# EAGLE design Dispenser (EAGLE 6.3)
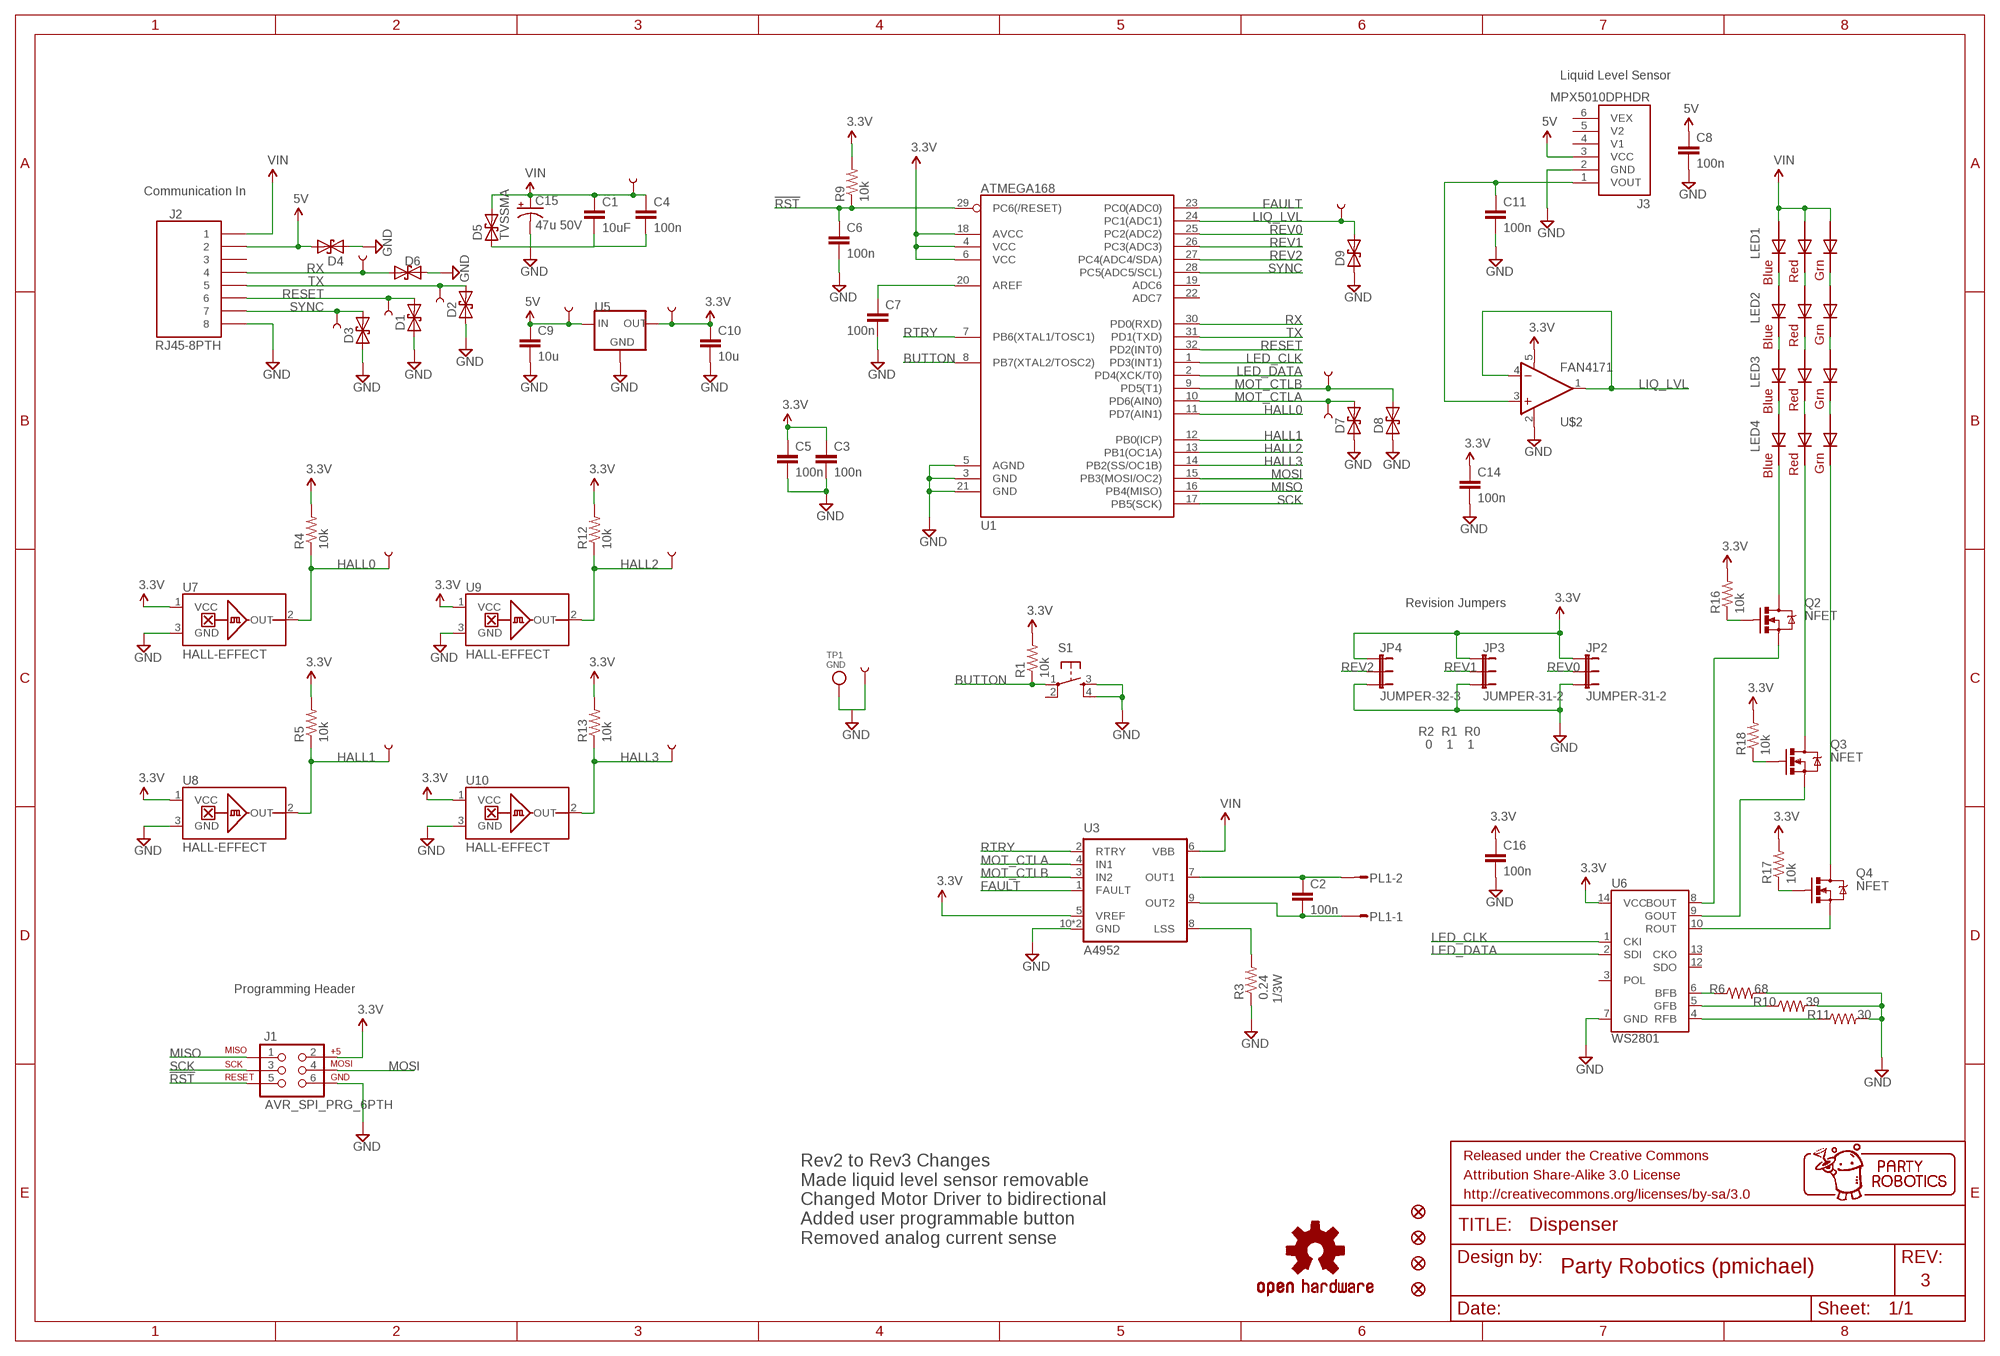
[diagram p0: schematic, sheet 1]

## Parts
C1  10uF  2.2UF-CERCAP-10009  [1206]
C2  100n  CAP0603-CAP  [0603-CAP]
C3  100n  CAP0603-CAP  [0603-CAP]
C4  100n  CAP0603-CAP  [0603-CAP]
C5  100n  CAP0603-CAP  [0603-CAP]
C6  100n  CAP0603-CAP  [0603-CAP]
C7  100n  CAP0603-CAP  [0603-CAP]
C8  100n  CAP0603-CAP  [0603-CAP]
C9  10u  CAP0603-CAP  [0603-CAP]
C10  10u  CAP0603-CAP  [0603-CAP]
C11  100n  CAP0603-CAP  [0603-CAP]
C14  100n  CAP0603-CAP  [0603-CAP]
C15  47u 50V  CAP_POLD  [PANASONIC_D]
C16  100n  CAP0603-CAP  [0603-CAP]
D1  TVSSOD-923  [SOD-923]
D2  TVSSOD-923  [SOD-923]
D3  TVSSOD-923  [SOD-923]
D4  TVSSOD-923  [SOD-923]
D5  TVSSMA  [SMA-DIODE]
D6  TVSSOD-923  [SOD-923]
D7  TVSSOD-923  [SOD-923]
D8  TVSSOD-923  [SOD-923]
D9  TVSSOD-923  [SOD-923]
FRAME3  FRAME-LETTER  [CREATIVE_COMMONS]
J1  AVR_SPI_PRG_6PTH  [2X3]
J2  RJ45-8PTH  [RJ45-8]
J3  MPX5010DPHDR  [MPX5010_HDR]
JP2  JUMPER-31-2  [SJ_3_PASTE1&2]
JP3  JUMPER-31-2  [SJ_3_PASTE1&2]
JP4  JUMPER-32-3  [SJ_3_PASTE2&3]
JP5  FIDUCIAL1X2  [FIDUCIAL-1X2]
JP6  FIDUCIAL1X2  [FIDUCIAL-1X2]
JP7  FIDUCIAL1X2  [FIDUCIAL-1X2]
JP8  FIDUCIAL1X2  [FIDUCIAL-1X2]
LED1  RGBLED5050  [RGBLED5050]
LED2  RGBLED5050  [RGBLED5050]
LED3  RGBLED5050  [RGBLED5050]
LED4  RGBLED5050  [RGBLED5050]
PL1  DF3-02P  [DF3P-02]
Q2  NFET  MOSFET-NCHANNELSMD  [SOT23-3]
Q3  NFET  MOSFET-NCHANNELSMD  [SOT23-3]
Q4  NFET  MOSFET-NCHANNELSMD  [SOT23-3]
R1  10k  RESISTOR0603-RES  [0603-RES]
R3  0.24  RESISTOR0805-RES  [0805]
R4  10k  RESISTOR0603-RES  [0603-RES]
R5  10k  RESISTOR0603-RES  [0603-RES]
R6  68  RESISTOR0603-RES  [0603-RES]
R9  10k  RESISTOR0603-RES  [0603-RES]
R10  39  RESISTOR0603-RES  [0603-RES]
R11  30  RESISTOR0603-RES  [0603-RES]
R12  10k  RESISTOR0603-RES  [0603-RES]
R13  10k  RESISTOR0603-RES  [0603-RES]
R16  10k  RESISTOR0603-RES  [0603-RES]
R17  10k  RESISTOR0603-RES  [0603-RES]
R18  10k  RESISTOR0603-RES  [0603-RES]
S1  TAC_SWITCHSMD  [TACTILE_SWITCH_SMD]
TP1  GND  TESTPOINT  [TESTPOINT_SMT]
TP2  TEST-POINT0.08  [PAD_0.08]
TP3  TEST-POINT0.08  [PAD_0.08]
TP4  TEST-POINT0.08  [PAD_0.08]
TP5  TEST-POINT0.08  [PAD_0.08]
TP6  TEST-POINT0.08  [PAD_0.08]
TP7  TEST-POINT3X5  [PAD.03X.05]
TP8  TEST-POINT3X5  [PAD.03X.05]
TP9  TEST-POINT3X5  [PAD.03X.05]
TP10  TEST-POINT3X5  [PAD.03X.05]
TP11  TEST-POINT3X5  [PAD.03X.05]
TP12  TEST-POINT3X5  [PAD.03X.05]
TP13  TEST-POINT0.08  [PAD_0.08]
TP14  TEST-POINT0.08  [PAD_0.08]
TP15  TEST-POINT0.08  [PAD_0.08]
TP16  TEST-POINT0.08  [PAD_0.08]
U1  ATMEGA168  [TQFP32-08]
U3  A4952  [MSOP-10-GNDPAD]
U5  VREG-5V-LDO-AP1117SOT89-3L  [SOT89-3L]
U6  WS2801  [SOP-14]
U7  HALL-EFFECT  [SOT23-3]
U8  HALL-EFFECT  [SOT23-3]
U9  HALL-EFFECT  [SOT23-3]
U10  HALL-EFFECT  [SOT23-3]
U$1  OSHW-LOGOM  [OSHW-LOGO-M]
U$2  FAN4171  OPA344  [SOT23-5]

## Nets
1/3W: R3.2 U3.8(LSS)
3.3V: C3.1 C5.1 C10.1 C14.1 C16.1 J1.2 JP2.1 JP3.1 JP4.1 R1.2 R4.2 R5.2 R9.2 R12.2 R13.2 R16.2 R17.2 R18.2 TP16.P$1 U1.4(VCC) U1.6(VCC) U1.18(AVCC) U3.5(VREF) U5.2(OUT) U5.2.1(OUT) U6.14(VCC) U7.1(VCC) U8.1(VCC) U9.1(VCC) U10.1(VCC) U$2.5(V+)
5V: C8.1 C9.1 D4.C J2.2 J3.3(VCC) TP3.P$1 U5.3(IN)
!RST: C6.1 J1.5 R9.1 U1.29(PC6(/RESET))
BLUE: Q2.2(S) U6.8(BOUT)
BUTTON: R1.1 S1.1 U1.8(PB7(XTAL2/TOSC2))
FAULT: U1.23(PC0(ADC0)) U3.1(FAULT)
GND: C1.2 C3.2 C4.2 C5.2 C6.2 C7.2 C8.2 C9.2 C10.2 C11.2 C14.2 C15.- C16.2 D1.A D2.A D3.A D4.A D5.A D6.A D7.A D8.A D9.A J1.6 J2.8 J3.2(GND) JP2.3 JP3.3 JP4.3 R3.1 R6.2 R10.2 R11.2 S1.3 S1.4 TP1.P$1 TP2.P$1 U1.3(GND) U1.5(AGND) U1.21(GND) U3.10(GND) U3.GND U5.1(GND) U6.7(GND) U7.3(GND) U8.3(GND) U9.3(GND) U10.3(GND) U$2.2(V-)
GREEN: Q3.2(S) U6.9(GOUT)
HALL0: R4.1 TP10.P$1 U1.11(PD7(AIN1)) U7.2(OUT)
HALL1: R5.1 TP11.P$1 U1.12(PB0(ICP)) U8.2(OUT)
HALL2: R12.1 TP9.P$1 U1.13(PB1(OC1A)) U9.2(OUT)
HALL3: R13.1 TP12.P$1 U1.14(PB2(SS/OC1B)) U10.2(OUT)
LED_CLK: U1.1(PD3(INT1)) U6.1(CKI)
LED_DATA: U1.2(PD4(XCK/T0)) U6.2(SDI)
LIQ_LVL: D9.C TP14.P$1 U1.24(PC1(ADC1)) U$2.1(OUT) U$2.4(-IN)
MISO: J1.1 U1.16(PB4(MISO))
MOSI: J1.4 U1.15(PB3(MOSI/OC2))
MOT_CTLA: D7.C TP8.P$1 U1.10(PD6(AIN0)) U3.4(IN1)
MOT_CTLB: D8.C TP7.P$1 U1.9(PD5(T1)) U3.3(IN2)
N$1: C7.1 U1.20(AREF)
N$2: Q3.1(G) R18.1
N$4: Q4.1(G) R17.1
N$5: Q2.1(G) R16.1
N$6: R6.1 U6.6(BFB)
N$7: R10.1 U6.5(GFB)
N$8: R11.1 U6.4(RFB)
N$9: C2.1 PL1.2 U3.7(OUT1)
N$10: C2.2 PL1.1 U3.9(OUT2)
N$12: LED4.6(BLUE_C) Q2.3(D)
N$13: LED4.5(RED_C) Q3.3(D)
N$14: LED4.4(GREEN_C) Q4.3(D)
N$17: Q4.2(S) U6.10(ROUT)
N$26: C11.1 J3.1(VOUT) U$2.3(+IN)
N$28: LED3.6(BLUE_C) LED4.1(BLUE_A)
N$34: LED3.5(RED_C) LED4.2(RED_A)
N$37: LED3.4(GREEN_C) LED4.3(GREEN_A)
N$38: LED2.4(GREEN_C) LED3.3(GREEN_A)
N$39: LED2.5(RED_C) LED3.2(RED_A)
N$40: LED2.6(BLUE_C) LED3.1(BLUE_A)
N$41: LED1.4(GREEN_C) LED2.3(GREEN_A)
N$42: LED1.5(RED_C) LED2.2(RED_A)
N$43: LED1.6(BLUE_C) LED2.1(BLUE_A)
RESET: D1.C J2.6 TP13.P$1 U1.32(PD2(INT0))
REV0: JP2.2 U1.25(PC2(ADC2))
REV1: JP3.2 U1.26(PC3(ADC3))
REV2: JP4.2 U1.27(PC4(ADC4/SDA))
RTRY: U1.7(PB6(XTAL1/TOSC1)) U3.2(RTRY)
RX: D6.C J2.4 TP4.P$1 U1.30(PD0(RXD))
SCK: J1.3 U1.17(PB5(SCK))
SYNC: D3.C J2.7 TP15.P$1 U1.28(PC5(ADC5/SCL))
TX: D2.C J2.5 TP5.P$1 U1.31(PD1(TXD))
VIN: C1.1 C4.1 C15.+ D5.C J2.1 LED1.1(BLUE_A) LED1.2(RED_A) LED1.3(GREEN_A) TP6.P$1 U3.6(VBB)
Unconnected: J2.3 J3.4(V1) J3.5(V2) J3.6(VEX) S1.2 U1.19(ADC6) U1.22(ADC7) U6.3(POL) U6.12(SDO) U6.13(CKO)

## Notes on the sheet
- Liquid Level Sensor
- Communication In
- Revision Jumpers
- R2  R1  R0
- 0    1    1
- Programming Header
- Rev2 to Rev3 Changes
  Made liquid level sensor removable
  Changed Motor Driver to bidirectional
  Added user programmable button
  Removed analog current sense
- Party Robotics (pmichael)
- 3
- C:/Users/Pierre/Dropbox/PartyRobotics/PartyRoboticsLogo/BW/Eagle-sch-logo.bmp

## Library data of the parts
C1 = SparkFun-Capacitors:2.2UF-CER: 2.2uF Ceramic SMT CAP-07888- 10V, 20% (0603) CAP-10009- 50V, 10% (1206); PROD_ID: CAP-10009; VALUE: 2.2uF
C2-C8 C11 C14 C16 = SparkFun:CAP: Capacitor Standard 0603 ceramic capacitor, and 0.1" leaded capacitor.
C9 C10 = SparkFun-Passives:CAP: Capacitor Standard 0603 ceramic capacitor, and 0.1" leaded capacitor.
C15 = SparkFun-Capacitors:CAP_POL: Capacitor Polarized These are standard SMD and PTH capacitors. Normally 10uF, 47uF, and 100uF in electrolytic and tantalum varieties. Always verify the external diameter of the through hole cap, it varies with capacity, voltage, and manufacturer. The EIA devices should be standard.
D1-D4 D6-D9 = pierre:TVS: Transient voltage suppressor- prevents ESD on inputs. Ignore package description- MBRA140 is NOT this type of part!!!
D5 = pierre:TVS: Transient voltage suppressor- prevents ESD on inputs. Ignore package description- MBRA140 is NOT this type of part!!!; MFG: Bourns; MFG_PN: SMAJ24CA; VENDOR: Digikey; VENDOR_PN: SMAJ24CABCT-ND
FRAME3 = SparkFun-Aesthetics:FRAME-LETTER: Schematic Frame Standard 8.5x11 US Letter frame
J1 = SparkFun-Connectors:AVR_SPI_PRG_6: AVR ISP 6 Pin This is the reduced ISP connector for AVR programming. Common on Arduino. This footprint will take up less PCB space and can be used with a 10-pin to 6-pin adapter such as SKU: BOB-08508
J2 = pierre:RJ45-8: RJ45 Jack Simple RJ45, 8-pin connection - connector for common Cat5, Cat5e, and Cat6 Ethernet cables. Footprint not yet proven in production. Connector sku is PRT-00643; Breakout PCB sku is BOB-00716.; DIST: DigiKey; DIST_PN: 151-1099-ND; MFG: EDAC Inc; MFG_PN: A00-108-220-450
J3 = pierre:MPX5010DP
JP2-JP4 = SparkFun-Passives:JUMPER-3
JP5-JP8 = SparkFun-Aesthetics:FIDUCIAL: Fiducial Alignment Points Various fiducial points for machine vision alignment.
LED1-LED4 = pierre:RGBLED: For 5050 RGB LEDs, the order of the LEDs may vary from one manufacturer to another!
PL1 = pierre:DF3-02: Single row connector 2mm 2 way
Q2-Q4 = SparkFun-DiscreteSemi:MOSFET-NCHANNEL: Generic NMOS footprint
R1 R3-R6 R9-R13 R16-R18 = SparkFun-Resistors:RESISTOR: Resistor Basic schematic elements and footprints for 0603, 1206, and PTH resistors.
S1 = pierre:TAC_SWITCH: Momentary Switch Button commonly used for reset or general input. Spark Fun Electronics SKU : COM-00097
TP1 = microbuilder:TESTPOINT: Test Point Various test points for characterisation and PCB testing TESTPOINT_SMT - Compact Surface Mount Test Point [Digikey: 5016KTR-ND]
TP2-TP6 TP13-TP16 = pierre:TEST-POINT: Bare copper test points for troubleshooting or ICT
TP7-TP12 = SparkFun-Passives:TEST-POINT: Bare copper test points for troubleshooting or ICT
U1 = SparkFun-DigitalIC:ATMEGA168: Atmel 32-pin 8-bit micro, 16k flash.
U3 = pierre:A4952: Allegro H-bridge Driver
U5 = pierre:VREG-5V-LDO-AP1117
U6 = SparkFun-DigitalIC:WS2801: WS2801 3 Channel Constant Current LED Driver with programmable PWM outputs. Datasheet: http://www.sparkfun.com/datasheets/Components/LED/WS2801.pdf
U7-U10 = pierre:HALL-EFFECT: Hall effect sensor in SC70 package
U$1 = pierre:OSHW-LOGO: Open Source Hardware Logo This logo indicates the piece of hardware it is found on incorporates a OSHW license and/or adheres to the definition of open source hardware found here: http://freedomdefined.org/OSHW
U$2 = SparkFun-AnalogIC:OPA344: Single gate rail-to-rail output op-amp. Inputs extend 300mV past rails.

## Board
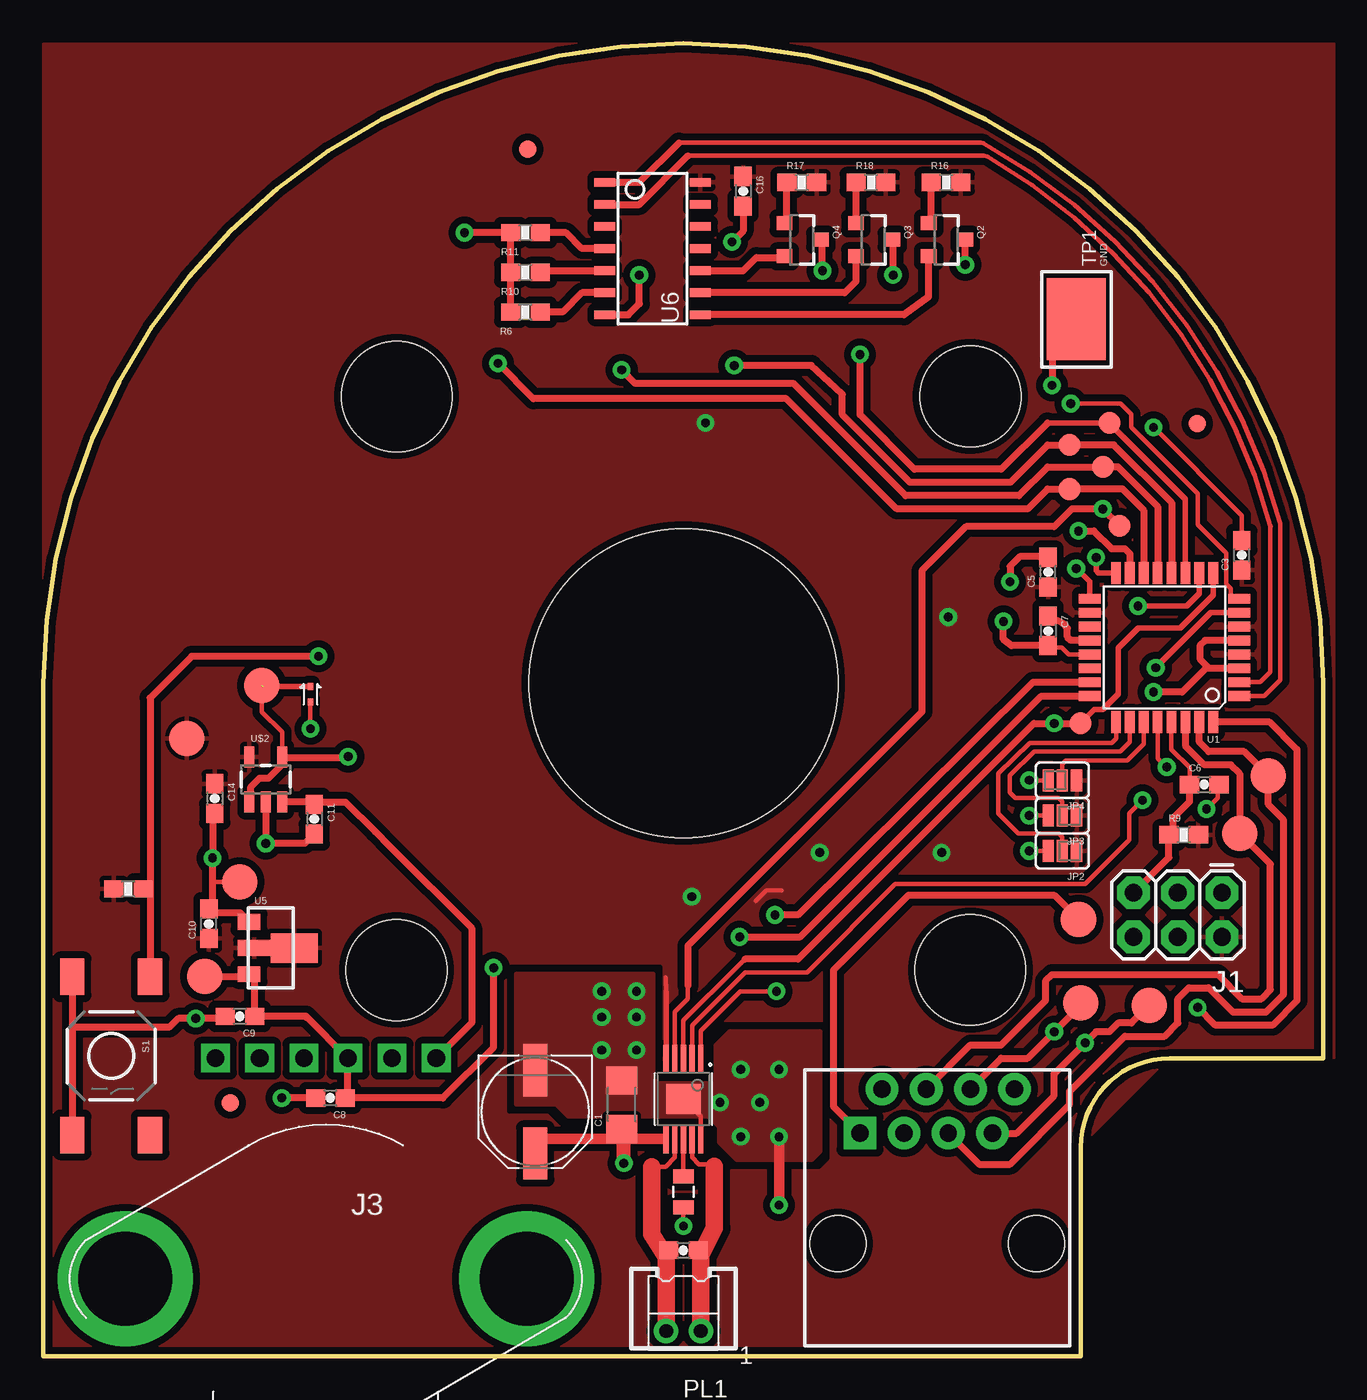
[diagram p1: board, top side]
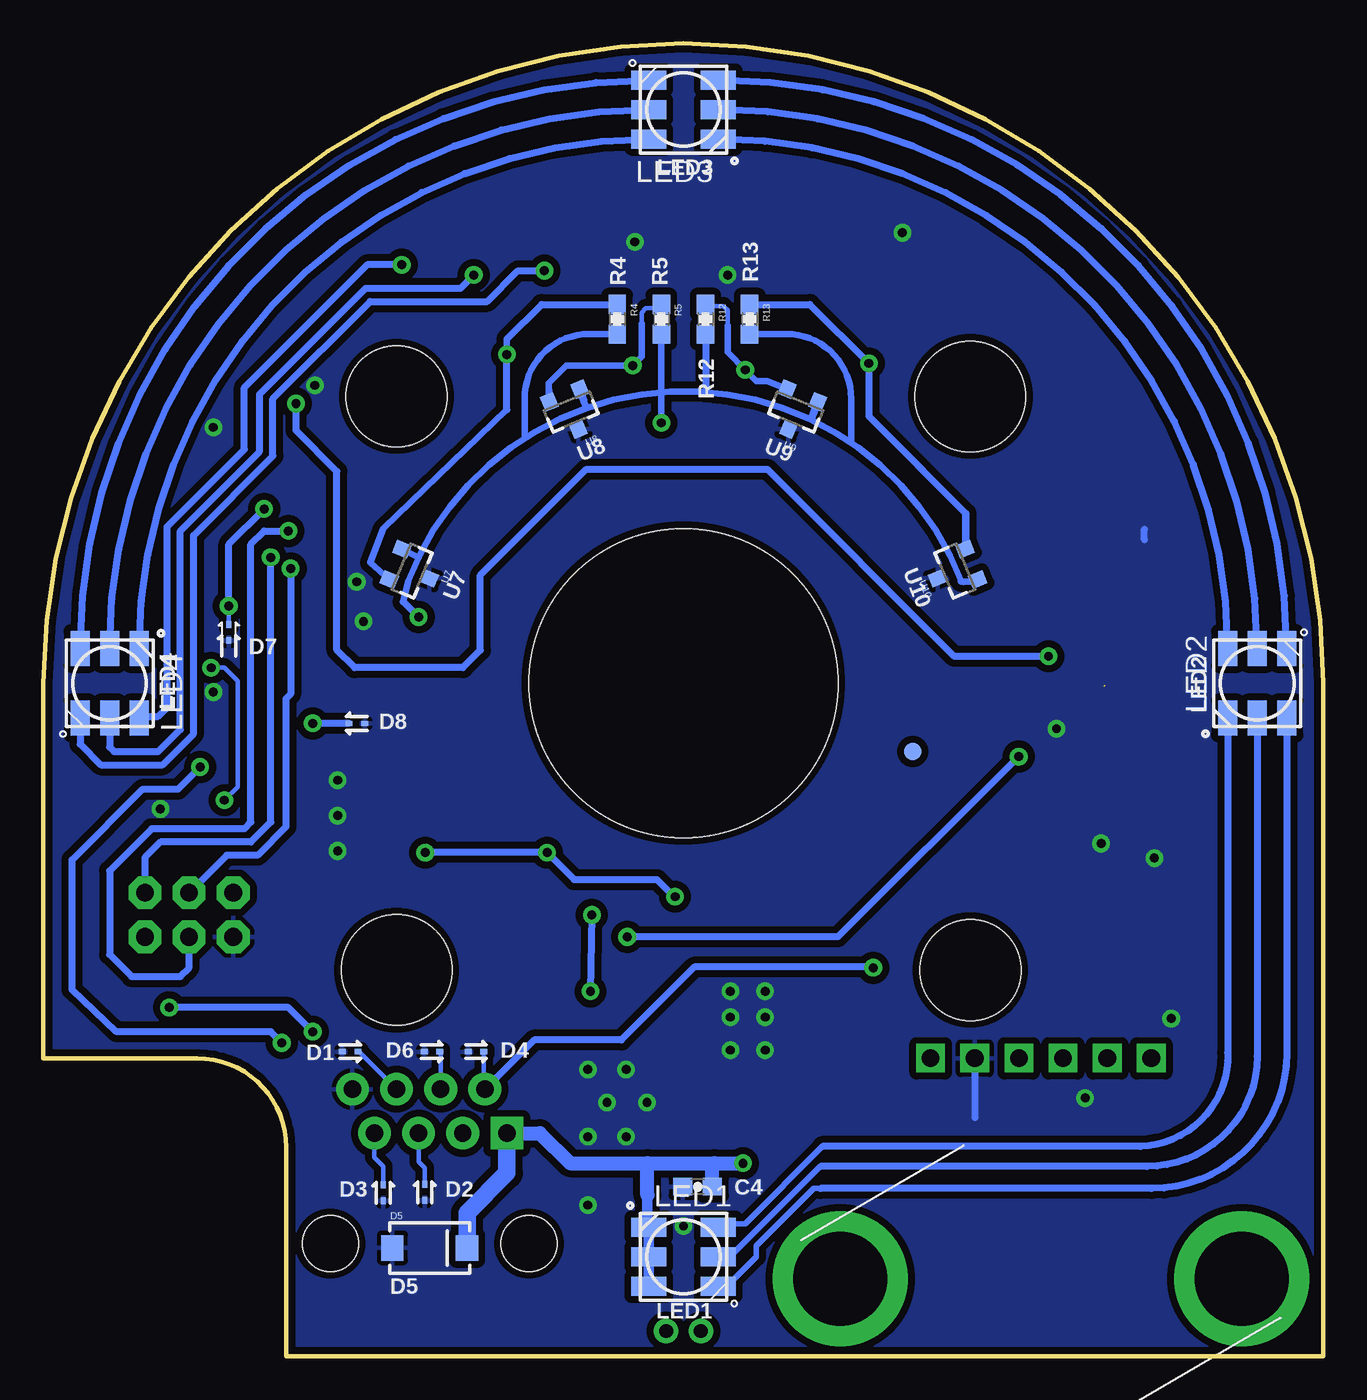
[diagram p2: board, bottom side, seen from below]

Size 73.66 x 75.56 mm. Coordinates in mm from the lower left corner, seen from the top.
Outline: 73.66,38.73 73.66,17.14 64.81,17.14 arc90 59.69,12.03 59.69,0 0,0 0,38.73 arc-180 73.66,38.73
Copper layers (1*16): Top 0.035mm / dielectric 1.5mm / Bottom 0.035mm
Design rules "SparkFun": minimum track width 8mil, minimum drill 20mil, track to track 8mil, track to pad 8mil, pad to pad 8mil, via to via 8mil, smd to smd 8mil, copper to edge 10mil, drill to drill 8mil, minimum pad ring 12mil, minimum via ring 10mil, stop-mask expansion 4mil, vias tented up to drill 25mil, thermal gap 10mil
Holes 6.35 mm at 20.32,55.24 53.34,22.23
Holes 5.79 mm at 53.34,55.24 20.32,22.23
Holes 17.78 mm at 36.83,38.73

### Footprints (pad centres in the part's own frame; a part is rotated, then mirrored left to right if it is on the bottom)
1206 = smd 1.6 x 1.8: 1 -1.4,0; 2 1.4,0
0603-CAP = smd 1.1 x 1: 1 -0.85,0; 2 0.85,0
PANASONIC_D = smd 3 x 1.4: + 2.4,0; - -2.4,0
SOD-923 = smd 0.4 x 0.3: A -0.45,0; C 0.45,0
SMA-DIODE = smd 1.27 x 1.47: A -2.15,0; C 2.15,0
2X3 = drill 1.016 pad 1.88 octagon: 1 0,0; 2 0,2.54; 3 2.54,0; 4 2.54,2.54; 5 5.08,0; 6 5.08,2.54
RJ45-8 = drill 1 pad 1.88 square: 1 -4.445,6.35 | drill 1 pad 1.88: 2 -3.175,8.89; 3 -1.905,6.35; 4 -0.635,8.89; 5 0.635,6.35; 6 1.905,8.89; 7 3.175,6.35; 8 4.445,8.89 | hole 3.2: -5.715,0; 5.715,0
MPX5010_HDR = drill 1.016 pad 1.651 square: 1 6.35,0; 2 3.81,0; 3 1.27,0; 4 -1.27,0; 5 -3.81,0; 6 -6.35,0 | drill 5.41 pad 7.772: P1 -11.557,-12.7; P2 11.557,-12.7
SJ_3_PASTE1&2 = smd 0.635 x 1.27: 1 -0.813,0; 2 0,0; 3 0.813,0
SJ_3_PASTE2&3 = smd 0.635 x 1.27: 1 -0.813,0; 2 0,0; 3 0.813,0
FIDUCIAL-1X2 = smd 1 x 1: 1 0,0
RGBLED5050 = smd 2 x 1.1: 1 -2,1.7; 2 -2,0; 3 -2,-1.7; 4 2,-1.7; 5 2,0; 6 2,1.7
DF3P-02 = drill 0.8: 1 -1,1; 2 1,1
SOT23-3 = smd 0.8 x 0.9: 1 -0.95,-1; 2 0.95,-1; 3 0,1.1
0603-RES = smd 1.1 x 1: 1 -0.85,0; 2 0.85,0
0805 = smd 0.8 x 1.2: 1 -0.9,0; 2 0.9,0
TACTILE_SWITCH_SMD = smd 2.1 x 1.4: 1 -4.55,2.24; 2 4.55,2.24; 3 -4.55,-2.24; 4 4.55,-2.24
TESTPOINT_SMT = smd 4.7 x 3.4: P$1 0,0
PAD_0.08 = smd 2.032 x 2.032: P$1 0,0
PAD.03X.05 = smd 1.27 x 1.27: P$1 0,0
TQFP32-08 = smd 1.27 x 0.559: 1 -4.293,2.8; 2 -4.293,2; 3 -4.293,1.2; 4 -4.293,0.4; 5 -4.293,-0.4; 6 -4.293,-1.2; 7 -4.293,-2; 8 -4.293,-2.8; 17 4.293,-2.8; 18 4.293,-2; 19 4.293,-1.2; 20 4.293,-0.4; 21 4.293,0.4; 22 4.293,1.2; 23 4.293,2; 24 4.293,2.8 | smd 0.559 x 1.27: 9 -2.8,-4.293; 10 -2,-4.293; 11 -1.2,-4.293; 12 -0.4,-4.293; 13 0.4,-4.293; 14 1.2,-4.293; 15 2,-4.293; 16 2.8,-4.293; 25 2.8,4.293; 26 2,4.293; 27 1.2,4.293; 28 0.4,4.293; 29 -0.4,4.293; 30 -1.2,4.293; 31 -2,4.293; 32 -2.8,4.293
MSOP-10-GNDPAD = smd 0.305 x 1.65: 1 -1,-2.3; 2 -0.5,-2.3; 3 0,-2.3; 4 0.5,-2.3; 5 1,-2.3; 6 1,2.3; 7 0.5,2.3; 8 0,2.3; 9 -0.5,2.3; 10 -1,2.3 | smd 1.98 x 1.73: GND 0,0
SOT89-3L = smd 0.9 x 1.3: 1 -1.5,-1.25; 3 1.5,-1.25 | smd 0.9 x 1.9: 2 0,-0.95 | smd 1.7 x 2.7: 2.1 0,1.35
SOP-14 = smd 0.5 x 1.2: 1 -3.81,-2.75; 2 -2.54,-2.75; 3 -1.27,-2.75; 4 0,-2.75; 5 1.27,-2.75; 6 2.54,-2.75; 7 3.81,-2.75; 8 3.81,2.75; 9 2.54,2.75; 10 1.27,2.75; 11 0,2.75; 12 -1.27,2.75; 13 -2.54,2.75; 14 -3.81,2.75
SOT23-5 = smd 0.55 x 1.2: 1 -0.95,-1.3; 2 0,-1.3; 3 0.95,-1.3; 4 0.95,1.3; 5 -0.95,1.3

### Placement (x,y rotation side)
C1  33.27,14.48 90 top
C2  36.83,6.1 0 top
C3  68.96,46.1 90 top
C4  36.02,9.75 180 bottom
C5  57.81,45.13 90 top
C6  66.8,32.89 0 top
C7  57.81,41.75 270 top
C8  16.51,14.86 180 top
C9  11.3,19.56 180 top
C10  9.53,24.89 90 top
C11  15.59,30.91 270 top
C14  9.86,32.1 270 top
C15  28.3,14.06 270 top
C16  40.26,67.06 270 top
D1  56.01,17.53 0 bottom
D2  51.72,9.43 90 bottom
D3  54.1,9.4 90 bottom
D4  48.77,17.53 0 bottom
D5  51.44,6.22 0 bottom
D6  51.31,17.53 0 bottom
D7  62.99,41.66 90 bottom
D8  55.63,36.42 180 bottom
D9  15.37,38.1 90 top
FRAME3  18.41,84.2 0 top  (outside the outline)
J1  67.82,26.67 180 top
J2  51.44,6.48 0 top
J3  16.26,17.14 0 top
JP2  58.64,29.08 180 top
JP3  58.64,31.11 180 top
JP4  58.64,33.15 180 top
JP5  27.87,69.48 0 top
JP6  23.62,34.8 0 bottom
JP7  66.41,53.68 0 top
JP8  10.74,14.59 0 top
LED1  36.83,5.71 0 bottom
LED2  3.81,38.73 90 bottom
LED3  36.83,71.75 180 bottom
LED4  69.85,38.73 270 bottom
PL1  36.83,2.44 180 top
Q2  51.94,64.26 270 top
Q3  47.75,64.26 270 top
Q4  43.64,64.26 270 top
R1  4.89,26.89 180 top
R3  36.83,9.45 90 top
R4  40.64,59.69 270 bottom
R5  38.1,59.69 270 bottom
R6  27.74,60.1 180 top
R9  65.62,30 0 top
R10  27.74,62.38 180 top
R11  27.74,64.67 180 top
R12  35.56,59.69 270 bottom
R13  33.02,59.69 270 bottom
R16  51.94,67.56 0 top
R17  43.64,67.56 0 top
R18  47.62,67.56 0 top
S1  3.9,17.28 270 top
TP1  59.44,59.69 90 top
TP2  11.3,27.3 0 top
TP3  9.27,21.84 0 top
TP4  68.83,30.1 0 top
TP5  70.48,33.4 0 top
TP6  59.56,25.15 0 top
TP7  59.69,36.42 0 top
TP8  61.93,47.8 0 top
TP9  60.96,51.18 0 top
TP10  61.34,53.72 0 top
TP11  59.05,52.45 0 top
TP12  59.05,49.91 0 top
TP13  59.69,20.32 0 top
TP14  12.57,38.61 0 top
TP15  63.63,20.19 0 top
TP16  8.26,35.56 0 top
U1  64.52,40.79 180 top
U3  36.83,14.8 180 top
U5  13.08,23.5 270 top
U6  35.05,63.75 270 top
U7  52.47,45.2 247.5 bottom
U8  43.3,54.37 202.5 bottom
U9  30.36,54.37 157.5 bottom
U10  21.19,45.2 112.5 bottom
U$1  64.52,56.64 0 top
U$2  12.79,33.2 0 top

### Tracks (layer width: path | path; a pad name or v marks a point on that pad's centre or on a via)
1/3W
  Top 0.254: U3.8 R3.2
3.3V  (via drill 0.51)
  Top 0.254: 35.83,20.97 35.8,21.8 35.8,21.4 | 41,26.2 41.6,26.8 42.49,26.8
  Top 0.305: U3.5 35.83,20.97
  Bottom 0.254: 45.97,52.83 43.69,54.1 42.42,54.61 40.89,54.99 38.1,55.5 | R13.2 33.15,58.8 | 38.1,55.5 35.56,55.5 32.89,55.12 29.59,53.98 | 38.1,53.59 38.1,55.5
  Bottom 0.381: U10.1 19.91,44.58 20.7,44.58 | R4.2 42.25,58.84 arc-90 45.97,55.12 45.97,52.83 | R13.2 30.9,58.84 arc90 27.18,55.12 27.18,52.58 27.94,53.09 29.59,53.98 29.46,53.98 | 52.68,44.6 arc138 20.85,44.6 | U9.1 29.34,54.23 | 42.55,54.99 U8.1 42.93,55.83 42.42,54.61 | R12.2 35.56,55.88 | R5.2 38.1,55.5 v38.1,53.72 | 52.68,44.6 52.96,43.43 | U7.1 52.07,45.97 52.68,44.6
  Bottom 0.406: 52.96,43.43 v52.07,42.55 | R13.2 33.02,58.8 | 35.56,58.93 R12.2 35.56,55.5 | 29.39,54.2 U9.1 29.46,53.98 | 42.93,55.83 42.55,54.91 | 20.85,44.6 20.7,44.58 | v51.69,28.98 v44.68,28.98 43.13,27.43 38.35,27.43 37.37,26.44 v37.31,26.44
  pour Top (isolate 0.406, rank 2): 0,0 0,75.56 74.3,75.56 74.3,17.14 64.77,17.14 59.69,12.06 59.69,0
5V  (via drill 0.51)
  Top 0.406: 15.18,19.49 J3.3 17.53,15.03 C8.1 22.99,14.86 25.91,17.78 v25.91,22.35 | 15.18,19.49 15.11,19.56 C9.1 | C9.1 12.18,19.58 | U5.3 11.77,21.94 | 15.13,19.49 15.18,19.49 | 11.83,21.72 U5.3 | C9.1 12.15,21.67 U5.3 | TP3.P$1 11.68,21.84 U5.3
  Bottom 0.254: J2.2 48.32,15.43 D4.C
  Bottom 0.406: J2.2 45.43,18.2 40.4,18.2 36.2,22.4 25.91,22.4 v25.91,22.35
!RST
  Top 0.254: 64.9,36.48 64.9,35.18 64.9,34.92 65.95,33.87 C6.1
  Top 0.406: U1.29 64.9,36.48 | J1.5 64.77,28.7 R9.1 65.02,30.26 65.02,30.99 65.95,31.92 C6.1
BLUE
  Top 0.406: Q2.2 50.93,63.3 50.93,60.96 49.53,59.94 U6.8
BUTTON  (via drill 0.51)
  Top 0.254: U1.8 68.71,43.69 68.33,43.69 68.33,44.2 68.07,44.45 68.07,46.23 66.42,47.88 66.42,49.66 62.61,53.47 62.61,54.23 62.01,54.83 v59.12,54.83
  Top 0.406: v15.83,40.28 8.53,40.28 6.14,37.89 6.14,26.67 | 6.14,26.67 S1.1 | R1.1 5.96,26.67 6.14,26.67
  Bottom 0.406: v15.83,40.28 21.23,40.28 32,51.05 42.42,51.05 48.51,44.96 48.51,40.64 49.53,39.62 55.75,39.62 56.77,40.64 56.77,50.93 59.12,53.28 v59.12,54.83
FAULT  (via drill 0.51)
  Top 0.254: v42.18,21 40.1,21 37.83,18.73 U3.1
  Top 0.406: U1.23 56.95,38.79 43.43,25.4 v42.1,25.4
  Bottom 0.406: v42.1,25.4 v42.18,21
GND  (via drill 0.51)
  Top 0.254: 68.85,41.15 U1.5 | JP4.3 v56.73,33.15 | JP3.3 v56.73,31.11 | JP2.3 v56.73,29.08 | U3.10 37.83,13.8 U3.GND | R3.1 v36.83,7.49 | 57.7,40.79 58.61,40.79 59,40.4 U1.21 | 57.42,40.79 57.7,40.79 | 57.7,40.79 C7.2 | v66.93,31.5 67.56,32.13 67.56,32.89 C6.2 | D9.A v15.37,36.12 | v63.88,53.47 68.96,48.39 C3.2 | TP2.P$1 9.73,27.3 9.73,27.56
  Top 0.305: 57.32,46.02 C5.2
  Top 0.406: TP1.P$1 arc90 59.05,59.18 58.04,58.17 v58.04,55.88 | v24.23,64.67 R11.2 R10.2 R6.2 | U6.7 33.66,59.94 34.29,60.58 v34.29,62.23 | C8.2 v13.72,14.86 | U1.21 | 55.26,42.3 v55.24,42.29 55.24,41.25 55.7,40.9 C7.2 | U1.5 66.85,41.19 66.55,40.89 66.55,40.13 67.09,39.59 | 15.41,29.98 C11.2 15.04,29.51 v12.79,29.51 U$2.2 | 57.32,46.02 56.18,46.02 55.63,45.47 v55.63,44.58 | C3.2 68.96,46.99 | U1.3 67.09,39.59 | 67.09,39.59 66.9,39.59 65.53,38.23 v63.88,38.23 | C16.2 40.26,64.77 v39.62,64.14 | 10.67,19.34 C9.2 10.33,19.43 v8.76,19.43 7.75,19.43 7.24,18.92 1.66,18.92 | 9.44,25.65 C10.2 | C10.2 9.56,25.74 9.78,25.53 11.3,25.53 U5.1 11.81,25.02 | C15.- 28.3,16.6 | C10.2 9.73,25.95 9.73,27.56 v9.73,28.67 9.73,31.12 C14.2 | S1.3 1.66,18.92 | 1.66,18.92 S1.4
  Top 0.61: v42.33,12.63 v42.33,8.69
  Bottom 0.254: v36.83,7.49 36.83,7.45
  Bottom 0.406: 10.3,47 10.3,47.6 | J3.2 20.07,13.72
  other vias: 40.13,16.5 40.13,12.63 38.93,14.6 32.13,17.62 34.13,17.62 42.33,16.5 41.23,14.6 32.13,19.51 34.13,19.51 34.13,21 32.13,21
  pour Bottom (isolate 0.406, rank 2): 0,0 0,75.56 74.3,75.56 74.3,17.14 65.41,17.14 59.69,11.43 59.69,0
  pour Top (no thermals): 38.3,13.8 30.2,13.8 29.5,14.5 27.2,14.5 27.2,22 35.1,22 35.1,15.9 35.3,15.7 38.7,15.7 38.7,17.9 39.5,18.7 44.7,18.7 44.7,11.8 44.2,11.3 39.9,11.3 38.9,12.3 38.9,13.2
GREEN
  Top 0.406: Q3.2 46.75,61.87 46.1,61.21 U6.9
HALL0  (via drill 0.51)
  Top 0.305: U1.11 65.72,49.35 TP10.P$1 57.78,53.72
  Top 0.406: v46.99,57.66 46.99,54.19 50.13,51.05 55.12,51.05 57.78,53.72
  Bottom 0.381: U7.2 54.86,45.69 54.1,47.62 46.99,54.48 | v46.99,57.66 46.99,58.55 | 40.64,60.45 R4.1
  Bottom 0.406: 46.99,58.55 45,60.54 R4.1 | 46.99,54.48 v46.99,57.66
HALL1  (via drill 0.51)
  Top 0.406: v39.75,57.02 44.2,57.02 45.97,55.37 45.97,54.19 49.87,50.29 55.63,50.29 57.78,52.45 TP11.P$1 61.59,52.45 64.92,49.13 U1.12
  Bottom 0.254: 39.24,59.44 39.24,60.07 38.99,60.33 38.35,60.33
  Bottom 0.381: 44.58,55.63 44.58,56.01 43.56,57.02 v39.75,57.02 39.24,57.53 39.24,59.44 | 38.23,60.33 38.35,60.33
  Bottom 0.406: 44.58,55.63 44.58,55.21 U8.2 | 38.23,60.33 38.23,60.41 R5.1
HALL2  (via drill 0.51)
  Top 0.406: v33.27,56.77 34.04,56.01 43.14,56.01 49.62,49.53 56.13,49.53 57.78,51.18 TP9.P$1 61.85,51.18 64.12,48.91 U1.13
  Bottom 0.254: 34.29,59.31 34.29,60.2 34.54,60.45 35.47,60.45 R12.1
  Bottom 0.305: U9.2 30.73,55.91
  Bottom 0.381: 34.29,59.31 34.29,57.78 v33.27,56.77 32.64,56.13 32,56.13 U9.2
HALL3  (via drill 0.51)
  Top 0.406: v26.16,57.15 28.19,55.12 42.76,55.12 49.11,48.77 56.64,48.77 57.78,49.91 TP12.P$1 62.1,49.91 63.32,48.7 U1.14
  Bottom 0.406: R13.1 29.55,60.54 v26.16,57.15 26.16,54.1 20.57,48.51 20.57,46.7 U10.2
LED_CLK
  Top 0.254: U1.1 70.25,37.99 71.17,38.91 71.17,47.93 arc46 54.08,69.83 53.98,69.85 36.58,69.85
  Top 0.406: U6.1 34.29,67.56 36.58,69.85
LED_DATA
  Top 0.254: U1.2 70.03,38.79 70.61,39.37 70.61,47.75 arc90 70.61,47.78 arc45 54.33,69.04 54.15,69.09 37.08,69.09
  Top 0.406: U6.2 34.29,66.29 37.08,69.09
LIQ_LVL  (via drill 0.51)  (1 unrouted)
  Top 0.254: U$2.4 13.74,35.91 12.57,37.08 TP14.P$1
  Top 0.305: D9.C 12.63,38.55
  Top 0.406: v40.06,24.13 43.56,24.13 57.42,37.99 U1.24 | 11.84,31.75 U$2.1 11.94,31.99 11.94,32.77 12.45,33.27 12.95,33.27 13.74,34.06 U$2.4 13.77,34.47 17.49,34.47 v17.53,34.51
  Bottom 0.406: v40.06,24.13 27.94,24.13 17.69,34.38 17.66,34.38 v17.53,34.51
MISO  (via drill 0.51)
  Top 0.305: v60.58,45.97 60.58,45.21 60.71,45.09 U1.16
  Top 0.406: 61.72,45.47 U1.16
  Bottom 0.406: v60.58,45.97 60.58,30.73 61.72,29.59 66.93,29.59 67.82,28.7 J1.1
MOSI  (via drill 0.51)
  Top 0.406: v59.56,47.5 60.45,47.5 61.47,46.48 62.23,46.48 62.52,46.2 U1.15
  Bottom 0.406: v59.56,47.5 60.96,47.5 61.72,46.74 61.72,30.73 62.1,30.35 67.44,30.35 69.85,27.94 69.85,23.11 68.58,21.84 65.79,21.84 65.28,22.35 J1.4
MOT_CTLA  (via drill 0.51)
  Top 0.254: U3.4 36.33,19.8 37.08,20.56 37.08,21.59
  Top 0.305: U1.10 66.52,43.91 65.79,43.18 v62.99,43.18
  Top 0.406: 37.08,21.34 37.08,21.59 37.08,23.62 50.55,37.08 50.55,45.21 53.09,47.75 58.17,47.75 59.18,48.77 v60.96,48.77 TP8.P$1
  Bottom 0.254: D7.C v62.99,43.18
  Bottom 0.406: v62.99,43.18 62.99,46.74 v60.96,48.77
MOT_CTLB  (via drill 0.51)
  Top 0.254: U3.3 36.83,19.34 38.1,20.61 38.61,21.08 40.39,22.86
  Top 0.305: U1.9 67.32,43.82 65.41,41.91 62.99,41.91 61.85,40.77 61.85,38.1 60.96,37.21 60.48,37.21 TP7.P$1
  Top 0.406: 40.39,22.86 43.43,22.86 57,36.42 v58.17,36.42 TP7.P$1 60.05,36.42
  Bottom 0.406: D8.C v58.17,36.42
N$1
  Top 0.406: U1.20 59.14,41.19 58.93,41.4 58.93,41.91 58.67,42.16 57.85,42.56 C7.1
N$2
  Top 0.406: Q3.1 46.77,65.23 R18.1
N$3
  Bottom 0.406: 25.4,53.34 20.57,48.51 20.57,46.74
N$4
  Top 0.406: Q4.1 42.79,65.36 R17.1
N$5
  Top 0.406: 50.94,67.46 R16.1 51.09,65.36 Q2.1
N$6
  Top 0.406: U6.6 30.99,61.21 29.87,60.1 R6.1
N$7
  Top 0.406: R10.1 28.69,62.48 U6.5
N$8
  Top 0.406: U6.4 30.99,63.75 30.07,64.67 R11.1
N$9
  Top 0.254: U3.7 36.33,11.43 35.8,10.9 35,10.9 | C2.1 35.98,4.47 35.83,4.32
  Top 1.016: PL1.2 35.83,4.32 35.83,5.69 35,7.01 35,10.9
N$10
  Top 0.254: U3.9 37.33,11.44 37.72,11.05 38.48,11.05 38.61,10.92
  Top 0.61: C2.2 37.68,4.47 37.83,4.32
  Top 1.016: PL1.1 37.83,4.32 37.83,5.83 38.61,7.37 38.61,10.92
N$12  (via drill 0.51)
  Top 0.406: v53.04,62.82 Q2.3
  Bottom 0.406: LED4.6 68.06,36.83 67.06,36.83 66.55,37.34 66.55,47.75 62.1,52.2 62.1,55.75 55.03,62.82 v53.04,62.82
N$13  (via drill 0.51)
  Top 0.406: v48.9,62.23 48.9,64.22 Q3.3
  Bottom 0.406: LED4.5 69.85,35.05 69.6,34.8 67.06,34.8 65.79,36.07 65.79,47.5 61.21,52.07 61.21,55.37 55.12,61.47 49.66,61.47 v48.9,62.23
N$14  (via drill 0.51)
  Top 0.406: v44.83,62.48 44.83,64.17 Q4.3
  Bottom 0.406: LED4.4 71.55,35.23 70.36,34.04 66.8,34.04 65.02,35.81 65.02,47.24 60.45,51.82 60.45,55.12 54.86,60.71 48.13,60.71 46.35,62.48 v44.83,62.48
N$17
  Top 0.406: U6.10 40.26,62.48 41.02,63.25 42.57,63.25 Q4.2
N$26
  Top 0.406: J3.1 24.64,19.18 24.64,24.64 19.94,29.34 19.08,30.2 17.38,31.9 15.45,31.9 | 15.62,31.8 C11.1 15.45,31.9 | 13.77,31.93 U$2.3 15.45,31.9
N$28
  Bottom 0.406: LED4.1 arc90 LED3.6
N$34
  Bottom 0.406: LED4.2 arc90 LED3.5
N$37
  Bottom 0.406: LED4.3 arc90 LED3.4
N$38
  Bottom 0.406: LED2.4 arc-90 LED3.3
N$39
  Bottom 0.406: LED2.5 arc-90 LED3.2
N$40
  Bottom 0.406: LED2.6 arc-90 LED3.1
N$41
  Bottom 0.305: LED1.4 34.83,4.03 34.8,4.06 34.29,4.06 32.64,5.71 32.64,6.35 29.34,9.65 28.96,9.65
  Bottom 0.406: LED2.3 2.11,17.45 arc90 9.91,9.65 28.96,9.65
N$42
  Bottom 0.305: 34.16,5.84 34.7,5.84 LED1.5 34.16,5.71 28.96,10.92
  Bottom 0.406: LED2.2 3.81,17.27 arc90 10.16,10.92 28.96,10.92
N$43
  Bottom 0.305: 28.83,12.06 33.27,7.62 34.29,7.62 34.49,7.42 LED1.6
  Bottom 0.406: LED2.1 5.51,17.48 arc90 10.54,12.06 28.83,12.06
RESET  (via drill 0.51)
  Top 0.406: J2.6 55.12,17.14 56.64,17.14 v58.17,18.67 59.69,20.19 TP13.P$1 | v66.42,20.07 67.44,19.05 70.74,19.05 72.14,20.45 72.14,34.92 70.56,36.5 U1.32
  Bottom 0.254: D1.C 55.5,17.53 J2.6
  Bottom 0.406: v58.17,18.67 59.56,20.07 v66.42,20.07
REV0
  Top 0.254: JP2.2 58.64,29.88 58.42,30.1 56.1,30.1 54.95,31.25 54.95,33.54 56.75,35.31 61.47,35.31 61.72,35.56 U1.25
REV1
  Top 0.254: 62.48,36.47 U1.26 62.52,35.34 61.98,34.8 57,34.8 55.62,33.41 55.62,32.44 55.92,32.13 58.42,32.13 58.64,31.92 JP3.2
REV2
  Top 0.254: U1.27 63.32,35.25 62.36,34.29 58.84,34.29 58.64,34.09 JP4.2
RTRY  (via drill 0.51)
  Top 0.254: U3.2 37.33,19.04 40.39,22.1 43.94,22.1 49.02,27.18 59.94,27.18 62.48,29.72 62.48,31.24 v63.25,32
  Top 0.305: U1.7 67.18,42.79 v64.01,39.62
  Bottom 0.254: v64.01,39.62 63.25,39.62 62.48,38.86 62.48,32.77 v63.25,32
RX
  Top 0.406: U1.30 65.72,35.12 66.8,34.04 68.33,34.04 68.83,33.53 TP4.P$1 70.61,28.32 70.61,21.08 70.1,20.57 68.96,20.57 67.56,21.97 58.04,21.97 57.66,21.59 57.66,20.45 55.12,17.91 53.34,17.91 J2.4
  Bottom 0.254: J2.4 50.8,17.47 D6.C
SCK  (via drill 0.51)
  Top 0.305: 60.2,43.62 60.2,44.58 v59.44,45.34
  Top 0.406: U1.17 arc-90 60.2,43.62
  Bottom 0.406: v59.44,45.34 59.44,38.1 59.69,37.85 59.69,30.48 61.34,28.83 63.12,28.83 J1.3
SYNC  (via drill 0.51)
  Top 0.254: U1.28 64.12,34.4 v64.64,33.91
  Top 0.406: J2.7 56.01,12.83 58.17,14.99 58.17,16.26 v59.94,18.03 60.58,18.67 61.34,18.67 61.85,19.18 62.61,19.18 TP15.P$1
  Bottom 0.254: J2.7 54.61,11.43 54.1,10.92 D3.C
  Bottom 0.406: v59.94,18.03 60.58,18.67 69.47,18.67 72.01,21.08 72.01,28.57 67.94,32.64 65.91,32.64 v64.64,33.91
TX
  Top 0.406: J2.5 53.85,11.05 55.63,11.05 59.05,14.48 59.05,15.24 62.23,18.41 64.52,18.41 65.28,19.18 65.28,20.57 65.91,21.21 67.06,21.21 68.45,19.81 70.36,19.81 71.37,20.83 71.37,30.86 70.48,31.75 TP5.P$1 69.09,34.8 67.06,34.8 66.52,35.34 U1.31
  Bottom 0.254: D2.C 51.72,10.82 52.07,11.18 J2.5
VIN  (via drill 0.51)
  Top 0.254: 33.27,12.5 28.6,12.5 28.4,12.3 | C1.1 33.71,13.08 34.29,12.5
  Top 0.305: U3.6 35.67,12.5
  Top 0.406: J2.1 45.47,14.35 45.47,22.23 49.78,26.54 58.17,26.54 TP6.P$1
  Top 0.61: C15.+ 28.3,11.01 | 35.67,12.5 34.29,12.5 33.27,12.5 28.52,12.5
  Top 0.813: v33.4,11.1 33.4,12.37 33.27,12.5
  Top 1.016: 28.4,12.5 28.4,12.3 28.4,11.76 C15.+
  Bottom 0.61: LED1.3 LED1.2 LED1.1 38.91,7.49 38.91,9.27 | LED1.3 38.86,4.01 | 38.3,4.01 LED1.3 | 34.6,11.1 v33.4,11.1
  Bottom 0.813: J2.1 45.09,12.83 43.36,11.1 38.91,11.1 | 38.91,11.1 35.05,11.1 | 35.05,11.1 v33.4,11.1 | 38.91,9.27 38.91,11.1 | C4.1 35.17,10.98 35.05,11.1
  Bottom 1.016: J2.1 46.99,10.54 49.28,8.25 D5.C

### Text on the board
_tplace: Released under the Creative Commons Attribution Share-Alike 3.0 License | http://creativecommons.org/licenses/by-sa/3.0 | Designed by: Pierre Michael and Robert Kaye | www.partyrobotics.com | U6 | R17 | R18 | R16 | R11 | R10 | GND | Q4 | Q3 | Q2 | R6 | Dispenser# | 0 | 1 | 2 | Hall | 3 | C3 | ID | C5 | IN1 | C7 | 3.3V | Liq | U1 | Lvl | U2 | IN2 | C6 | TX | C14 | 2 | 1 | Bartendro | Dispenser Board v3 | 0 | R9 | RX | C11 | GND | Rev | U5 | button | C10 | 24V | RST | J1 | 5V | C9 | J3 | SYNC | C8 | Liquid | Level | Sensor | USE | LEFT | PORT | 1 | MOTOR
_bplace: LED3 | R13 | R5 | R4 | R12 | U8 | U9 | U7 | U10 | D7 | LED4 | LED2 | D8 | D4 | D6 | D1 | D2 | D3 | D5 | LED1
200bmp: C16 | TP1 | JP1 | PL1